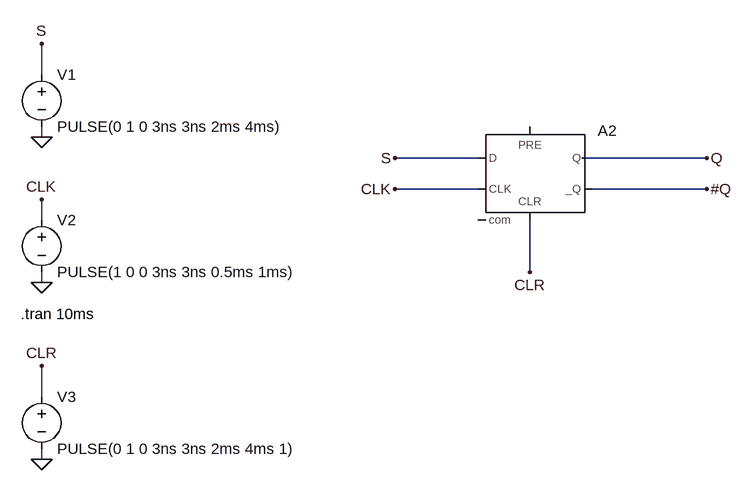
[diagram p0: schematic flipflop.asc]
flipflop.asc, the LTspice schematic file:
Version 4
SHEET 1 964 680
WIRE -368 -16 -368 -64
WIRE -368 80 -368 64
WIRE 304 112 176 112
WIRE 656 112 464 112
WIRE 304 160 176 160
WIRE 656 160 480 160
WIRE -368 208 -368 176
WIRE 384 288 384 208
WIRE -368 304 -368 288
WIRE -368 480 -368 432
WIRE -368 576 -368 560
FLAG 656 112 Q
FLAG 656 160 #Q
FLAG 176 160 CLK
FLAG 176 112 S
FLAG -368 80 0
FLAG -368 304 0
FLAG -368 176 CLK
FLAG -368 -64 S
FLAG -368 576 0
FLAG -368 432 CLR
FLAG 384 288 CLR
SYMBOL voltage -368 -32 R0
WINDOW 123 0 0 Left 0
WINDOW 39 0 0 Left 0
SYMATTR InstName V1
SYMATTR Value PULSE(0 1 0 3ns 3ns 2ms 4ms)
SYMBOL voltage -368 192 R0
WINDOW 123 0 0 Left 0
WINDOW 39 0 0 Left 0
SYMATTR InstName V2
SYMATTR Value PULSE(1 0 0 3ns 3ns 0.5ms 1ms)
SYMBOL Digital\\dflop 384 64 R0
SYMATTR InstName A2
SYMBOL voltage -368 464 R0
WINDOW 123 0 0 Left 0
WINDOW 39 0 0 Left 0
SYMATTR InstName V3
SYMATTR Value PULSE(0 1 0 3ns 3ns 2ms 4ms 1)
TEXT -400 352 Left 2 !.tran 10ms

The netlist it stands for:
* flipflop.asc
V1 S 0 PULSE(0 1 0 3ns 3ns 2ms 4ms)
V2 CLK 0 PULSE(1 0 0 3ns 3ns 0.5ms 1ms)
A2 S 0 CLK 0 CLR #Q Q 0 DFLOP
V3 CLR 0 PULSE(0 1 0 3ns 3ns 2ms 4ms 1)
.tran 10ms
.backanno
.end